# Altium schematic sheet nrf.SchDoc
size A
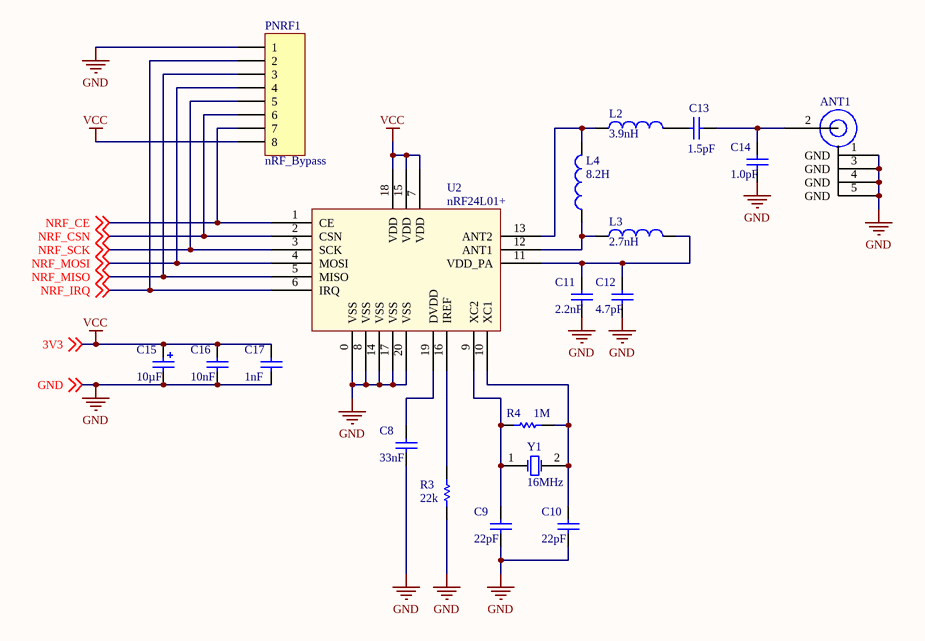
[diagram p0: nrf.SchDoc]

## Parts
ANT1  Connector  [RP-SMA]  (value not drawn)
C8  value 33nF  [0805-C]  (hidden comment: Cap)
C9  value 22pF  [0805-C]  (hidden comment: Cap)
C10  value 22pF  [0805-C]  (hidden comment: Cap)
C11  value 2.2nF  [0805-C]  (hidden comment: Cap)
C12  value 4.7pF  [0805-C]  (hidden comment: Cap)
C13  value 1.5pF  [0805-C]  (hidden comment: Cap)
C14  value 1.0pF  [0805-C]  (hidden comment: Cap)
C15  value 10µF  [0805-TC]  (hidden comment: Cap Pol1)
C16  value 10nF  [0805-C]  (hidden comment: Cap)
C17  value 1nF  [0805-C]  (hidden comment: Cap)
L2  value 3.9nH  [0402-L]  (hidden comment: Inductor)
L3  value 2.7nH  [0402-L]  (hidden comment: Inductor)
L4  value 8.2H  [0402-L]  (hidden comment: Inductor)
PNRF1  nRF_Bypass  [HDR1X8]
R3  value 22k  [0805-R]  (hidden comment: Res1)
R4  value 1M  [0805-R]  (hidden comment: Res1)
U2  nRF24L01+  [QFN50P400X400X95_HS-21N]
Y1  16MHz  [DFNCRY]

## Nets
GND: ANT1.1(GND) ANT1.3(GND) ANT1.4(GND) ANT1.5(GND) C8.1 C9.1 C10.1 C11.1 C12.1 C14.1 C15.2 C16.1 C17.1 PNRF1.1 R3.1 U2.0(VSS) U2.8(VSS) U2.14(VSS) U2.17(VSS) U2.20(VSS) ; off-sheet GND
VCC: C15.1 C16.2 C17.2 PNRF1.8 U2.7(VDD) U2.15(VDD) U2.18(VDD) ; off-sheet 3V3  [also labelled 3V3]
NRF_CE: PNRF1.7 U2.1(CE) ; off-sheet NRF_CE
NRF_CSN: PNRF1.6 U2.2(CSN) ; off-sheet NRF_CSN
NRF_IRQ: PNRF1.2 U2.6(IRQ) ; off-sheet NRF_IRQ
NRF_MISO: PNRF1.3 U2.5(MISO) ; off-sheet NRF_MISO
NRF_MOSI: PNRF1.4 U2.4(MOSI) ; off-sheet NRF_MOSI
NRF_SCK: PNRF1.5 U2.3(SCK) ; off-sheet NRF_SCK
NetANT1_2: ANT1.2(ANT) C13.2 C14.2
NetC8_2: C8.2 U2.19(DVDD)
NetC9_2: C9.2 R4.1 U2.9(XC2) Y1.1(OSC1)
NetC10_2: C10.2 R4.2 U2.10(XC1) Y1.2(OSC2)
NetC11_2: C11.2 C12.2 L3.2 U2.11(VDD_PA)
NetC13_1: C13.1 L2.2
NetL2_1: L2.1 L4.2 U2.13(ANT2)
NetL3_1: L3.1 L4.1 U2.12(ANT1)
NetR3_2: R3.2 U2.16(IREF)

## Library data of the parts
ANT1 = Antenna_Connector
C8-C14 C16 C17 = Cap: Capacitor; Published: 8-Jun-2000; LatestRevisionDate: 17-Jul-2002; LatestRevisionNote: Re-released for DXP Platform.; PackageReference: RAD-0.3; Publisher: Altium Limited; PackageDescription: Radial Cap, Thru-Hole; 2 Leads; 0.3 in Pin Spacing
C15 = Cap Pol1: Polarized Capacitor (Radial); Published: 8-Jun-2000; LatestRevisionDate: 17-Jul-2002; LatestRevisionNote: Re-released for DXP Platform.; PackageReference: RB7.6-15; Publisher: Altium Limited; PackageDescription: Polarized Capacitor (Radial); 2 Leads
L2-L4 = Inductor: Code_IEC: 1005; Published: 8-Jun-2000; LatestRevisionDate: 29-May-2009; LatestRevisionNote: IPC-7351 Footprint Added.; PackageReference: 0402-A; Publisher: Altium Limited; PackageDescription: Chip Inductor; Code_JEITA: 0402
PNRF1 = Header 8: Header, 8-Pin; LatestRevisionDate: 17-Jul-2002; LatestRevisionNote: Re-released for DXP Platform.; Publisher: Altium Limited
R3 R4 = Res1: Resistor; Published: 8-Jun-2000; LatestRevisionDate: 17-Jul-2002; LatestRevisionNote: Re-released for DXP Platform.; PackageReference: AXIAL-0.3; Publisher: Altium Limited; PackageDescription: Axial Device, Thru-Hole; 2 Leads; 0.3 in Pin Spacing
Y1 = XTAL: Crystal Oscillator; pin to pad: 2>3; Published: 8-Jun-2000; LatestRevisionDate: 17-Jul-2002; LatestRevisionNote: Re-released for DXP Platform.; PackageReference: R38; Publisher: Altium Limited; PackageDescription: Crystal, Thru-Hole; 2 Leads; Body 3.1 x 8.2 mm (Dia.xH)